# EasyEDA schematic 1-Schematic_PCnA_FinalProject.json
TITLE: Sheet_1; REV: 1.0; Date: 2024-12-01; Sheet: 1/1; Drawn By: rafaelmarvinjo; Company: Your Company
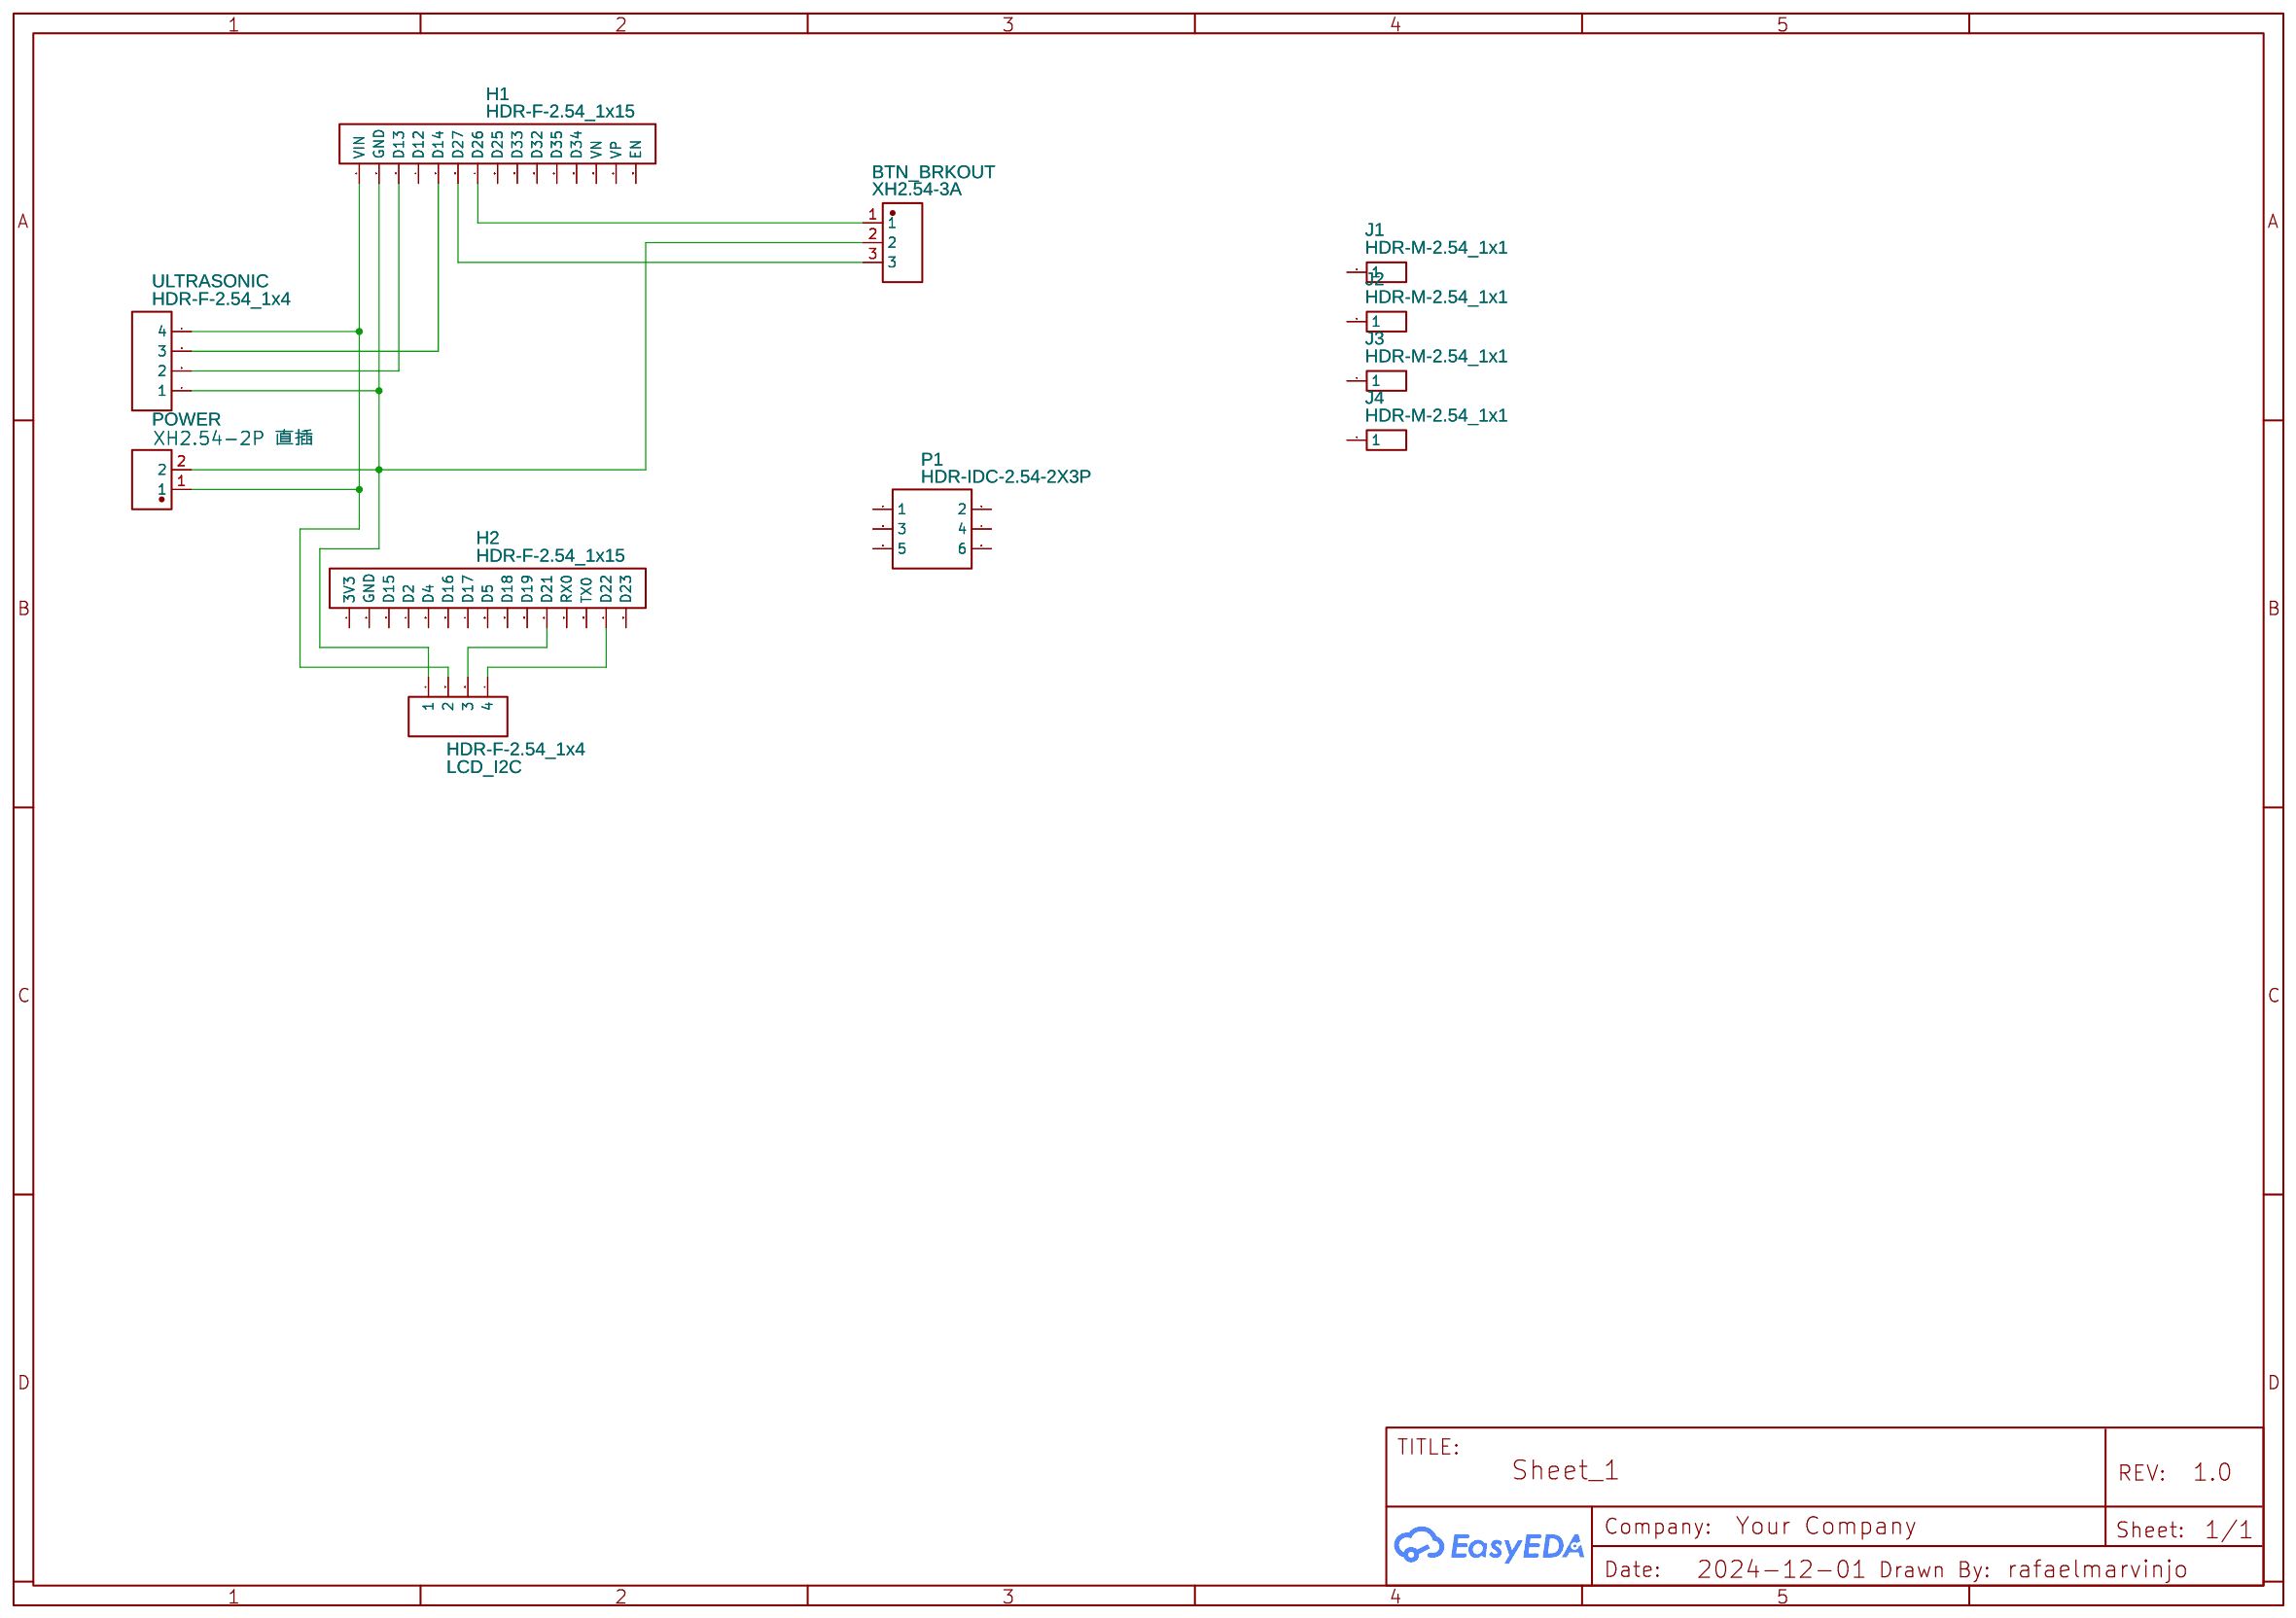
[diagram p0: schematic sheet]

## Parts
BTN_BRKOUT  XH2.54-3A  [CONN-TH_3P-P2.50_HCTL_XH-3A-L]
H1  HDR-F-2.54_1x15  [HDR-F-2.54_1X15]
H2  HDR-F-2.54_1x15  [HDR-F-2.54_1X15]
J1  HDR-M-2.54_1x1  [HDR-M-2.54_1X1]
J2  HDR-M-2.54_1x1  [HDR-M-2.54_1X1]
J3  HDR-M-2.54_1x1  [HDR-M-2.54_1X1]
J4  HDR-M-2.54_1x1  [HDR-M-2.54_1X1]
LCD_I2C  HDR-F-2.54_1x4  [HDR-F-2.54_1X4]
P1  HDR-IDC-2.54-2X3P  [IDC-TH_6P-P2.54_C11214]
POWER  XH2.54-2P 直插  [CONN-TH_2P-P2.50-XH2.54-2P]
ULTRASONIC  HDR-F-2.54_1x4  [HDR-F-2.54_1X4]

## Library data of the parts
BTN_BRKOUT = XH2.54-3A: Contributor: lcsc; Supplier: LCSC; Supplier Part: C9900018379; Manufacturer: null; JLCPCB Part Class: Extended Part
H1 H2 = HDR-F-2.54_1x15: Supplier Part: C124408; Supplier: LCSC; Contributor: LCEDA_Lib
J1-J4 = HDR-M-2.54_1x1: Supplier Part: C81276; Supplier: LCSC; Contributor: LCEDA_Lib
LCD_I2C ULTRASONIC = HDR-F-2.54_1x4: Supplier Part: C225501; Supplier: LCSC; Contributor: LCEDA_Lib
P1 = HDR-IDC-2.54-2X3P: Supplier: LCSC; Manufacturer: BOOMELE; Manufacturer Part: 2X3 2.54mm IDC Box; image: //image.lceda.cn/szlcsc/C11214.jpg; Supplier Part: C11214
POWER = XH2.54-2P 直插: Contributor: LCSC; Supplier: LCSC; Supplier Part: C9900000097; Manufacturer: null; JLCPCB Part Class: Extended Part

## Nets
Net-(BTN_BRKOUT-1): BTN_BRKOUT.1 H1.7(D26)
Net-(BTN_BRKOUT-2): BTN_BRKOUT.2 H1.2(GND) LCD_I2C.1 POWER.2 ULTRASONIC.1
Net-(BTN_BRKOUT-3): BTN_BRKOUT.3 H1.6(D27)
Net-(H1-1): H1.1(VIN) LCD_I2C.2 POWER.1 ULTRASONIC.4
Net-(H1-3): H1.3(D13) ULTRASONIC.2
Net-(H1-5): H1.5(D14) ULTRASONIC.3
Net-(H2-11): H2.11(D21) LCD_I2C.3
Net-(H2-14): H2.14(D22) LCD_I2C.4

Not connected (* = marked no-connect by the designer): H1 4(D12) 8(D25) 9(D33) 10(D32) 11(D35) 12(D34) 13(VN) 14(VP) 15(EN); H2 1(3V3) 2(GND) 3(D15) 4(D2) 5(D4) 6(D16) 7(D17) 8(D5) 9(D18) 10(D19) 12(RX0) 13(TX0) 15(D23); J1 1; J2 1; J3 1; J4 1; P1 1 2 3 4 5 6
